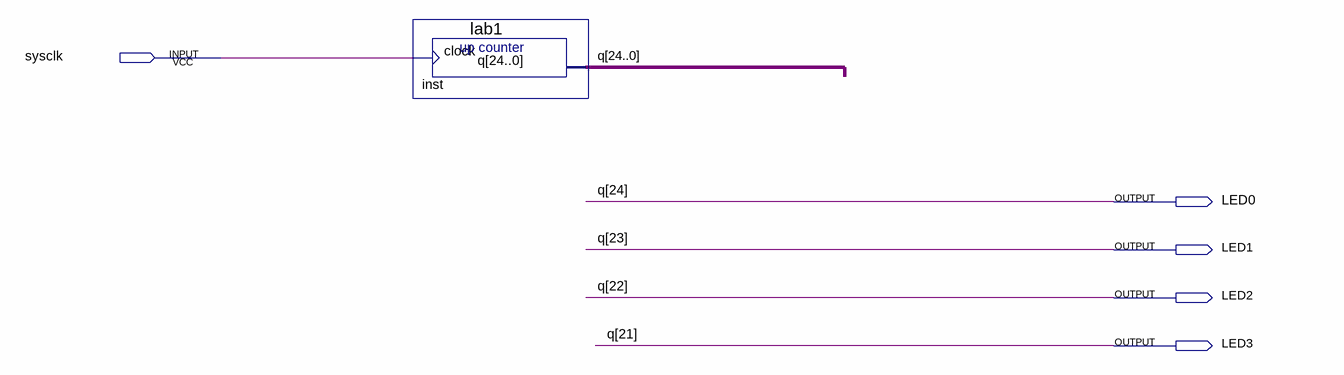
[diagram p0: schematic sheet]
// Quartus schematic Flip_flop_application.bdf as structural Verilog: 1 symbols, 5 pins
module Flip_flop_application (
  input  sysclk,
  output LED0,
  output LED1,
  output LED2,
  output LED3
);

  wire [20:0] q;

  lab1 inst (.clock(sysclk), .q({LED0, LED1, LED2, LED3, q}));

  // Other names for the same wires on the sheet: q[24:21] = {LED0, LED1, LED2, LED3}
endmodule
